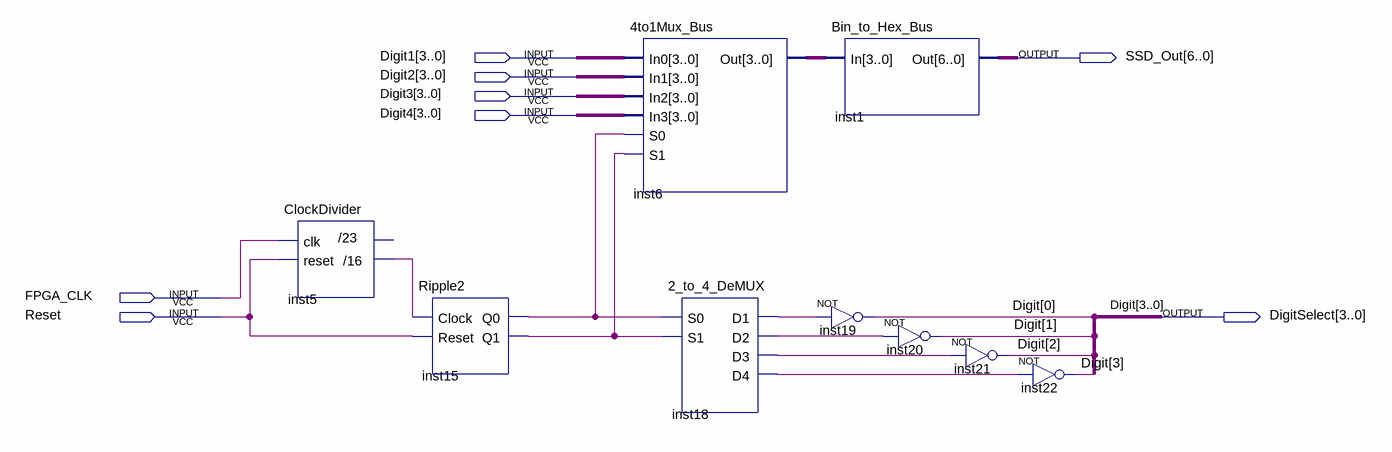
[diagram p0: schematic sheet]
// Quartus schematic SSD_Driver.bdf as structural Verilog: 9 symbols, 8 pins
module SSD_Driver (
  input  [3:0] Digit1,
  input  [3:0] Digit2,
  input  [3:0] Digit3,
  input  [3:0] Digit4,
  input  FPGA_CLK,
  input  Reset,
  output [6:0] SSD_Out,
  output [3:0] DigitSelect
);

  wire inst5__16, inst15_q0, inst15_q1, inst18_d1, inst18_d2, inst18_d3, inst18_d4;
  wire [3:0] inst6_out;

  ClockDivider inst5 (.clk(FPGA_CLK), .reset(Reset), .\/16 (inst5__16));  // open: /23
  Ripple2 inst15 (.Clock(inst5__16), .Reset(Reset), .Q0(inst15_q0), .Q1(inst15_q1));
  \4to1Mux_Bus  inst6 (
    .In0(Digit1), .In1(Digit2), .In2(Digit3), .In3(Digit4), .S0(inst15_q0), .S1(inst15_q1), .Out(inst6_out));
  \2_to_4_DeMUX  inst18 (
    .S0(inst15_q0), .S1(inst15_q1), .D1(inst18_d1), .D2(inst18_d2), .D3(inst18_d3), .D4(inst18_d4));
  not inst19 (DigitSelect[0], inst18_d1);
  Bin_to_Hex_Bus inst1 (.In(inst6_out), .Out(SSD_Out));
  not inst20 (DigitSelect[1], inst18_d2);
  not inst21 (DigitSelect[2], inst18_d3);
  not inst22 (DigitSelect[3], inst18_d4);

  // Other names for the same wires on the sheet: Digit[3:0] = DigitSelect
endmodule
